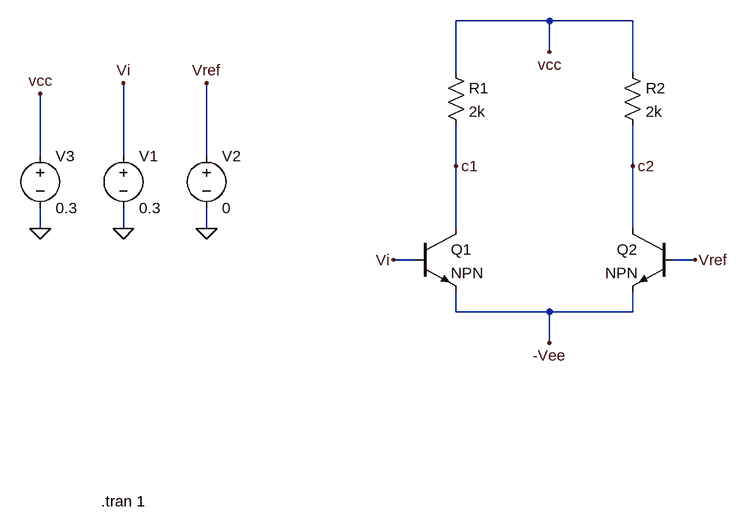
[diagram p0: schematic bipolar_transistor_s.asc]
bipolar_transistor_s.asc, the LTspice schematic file:
Version 4
SHEET 1 880 680
WIRE 352 -240 208 -240
WIRE 480 -240 352 -240
WIRE 352 -192 352 -240
WIRE 208 -160 208 -240
WIRE 480 -160 480 -240
WIRE -432 -32 -432 -128
WIRE -304 -32 -304 -144
WIRE -176 -32 -176 -144
WIRE 208 -16 208 -80
WIRE 480 -16 480 -80
WIRE -432 80 -432 48
WIRE -304 80 -304 48
WIRE -176 80 -176 48
WIRE 208 80 208 -16
WIRE 480 80 480 -16
WIRE 144 128 112 128
WIRE 576 128 544 128
WIRE 208 208 208 176
WIRE 352 208 208 208
WIRE 480 208 480 176
WIRE 480 208 352 208
WIRE 352 256 352 208
FLAG 352 -192 vcc
FLAG 112 128 Vi
FLAG 576 128 Vref
FLAG -304 -144 Vi
FLAG -176 -144 Vref
FLAG -304 80 0
FLAG -176 80 0
FLAG 208 -16 c1
FLAG 480 -16 c2
FLAG -432 80 0
FLAG -432 -128 vcc
FLAG 352 256 -Vee
SYMBOL npn 144 80 R0
SYMATTR InstName Q1
SYMBOL npn 544 80 M0
SYMATTR InstName Q2
SYMBOL res 192 -176 R0
SYMATTR InstName R1
SYMATTR Value 2k
SYMBOL res 464 -176 R0
SYMATTR InstName R2
SYMATTR Value 2k
SYMBOL voltage -304 -48 R0
WINDOW 123 0 0 Left 0
WINDOW 39 0 0 Left 0
SYMATTR InstName V1
SYMATTR Value 0.3
SYMBOL voltage -176 -48 R0
WINDOW 123 0 0 Left 0
WINDOW 39 0 0 Left 0
SYMATTR InstName V2
SYMATTR Value 0
SYMBOL voltage -432 -48 R0
WINDOW 123 0 0 Left 0
WINDOW 39 0 0 Left 0
SYMATTR InstName V3
SYMATTR Value 0.3
TEXT -338 500 Left 2 !.tran 1

The netlist it stands for:
* bipolar_transistor_s.asc
Q1 c1 Vi -Vee 0 NPN
Q2 c2 Vref -Vee 0 NPN
R1 vcc c1 2k
R2 vcc c2 2k
V1 Vi 0 0.3
V2 Vref 0 0
V3 vcc 0 0.3
.model NPN NPN
.model PNP PNP
.lib standard.bjt
.tran 1
.backanno
.end